# Altium schematic sheet rom.SchDoc: Test
size A4; DrawnBy: Łukasz Przeniosło; Organization: Apptimia sp. z o.o.; Address1: Wojska Polskiego 184c/4; Address2: 71-256 Szczecin; Address3: www.apptimia.com; DocumentNumber: 7; Revision: 1; SheetNumber: 7; SheetTotal: 12
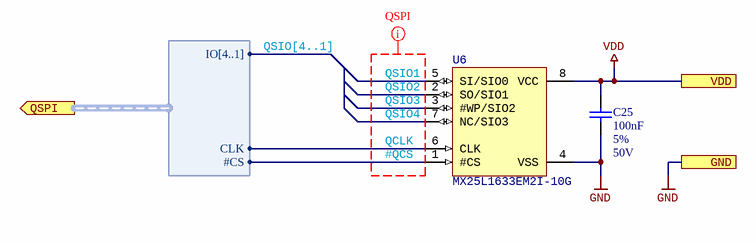
[diagram p0: rom.SchDoc]

## Parts
C25  100nF  Tolerance: 5%  Voltage: 50V  [CAPC1608N]
U6  MX25L1633EM2I-10G  [SOIC-8-WIDE]

## Ports
GND, QSPI (out, harness QSPI), VDD

## Harnesses
QSPI: IO[4..1], CLK, #CS

## Nets
GND: C25.1 U6.4(VSS) ; port GND
VDD: C25.2 U6.8(VCC) ; port VDD
#QCS: U6.1(#CS) ; port QSPI.#CS
QCLK: U6.6(CLK) ; port QSPI.CLK
QSIO1: U6.5(SI/SIO0)
QSIO2: U6.2(SO/SIO1)
QSIO3: U6.3(#WP/SIO2)
QSIO4: U6.7(NC/SIO3)

## Buses and harness runs
bus QSIO[4..1]

## Layout directives
net class QSPI: #QCS, QCLK, QSIO1, QSIO2, QSIO3, QSIO4

## Notes on the sheet
- Title
- Size:
- Date:
- A4
- Author:
- Time:
- Sheet
- of
- File:

## Library data of the parts
C25 = Capacitor: Value: 100nF
U6 = MX25L1633E: 16M-BIT [x 1/x 2/x 4] CMOS MXSMIO  (SERIAL MULTI I/O) FLASH MEMORY; manid: MX25L1633EM2I-10G